# Altium schematic sheet aaa_Empty_Schematic.SchDoc: Title
size A3; Date: not used; ApprovedBy: not used; CheckedBy: not used; Author: not used; CompanyName: not used; DrawnBy: Drawn by; Engineer: not used; Organization: SMS-Lab; Address1: not used; Address2: not used; Address3: not used; Address4: not used; DocumentNumber: SMS-yyyy.m; Revision: 0; Time: not used; ModifiedDate: not used; ImagePath: not used
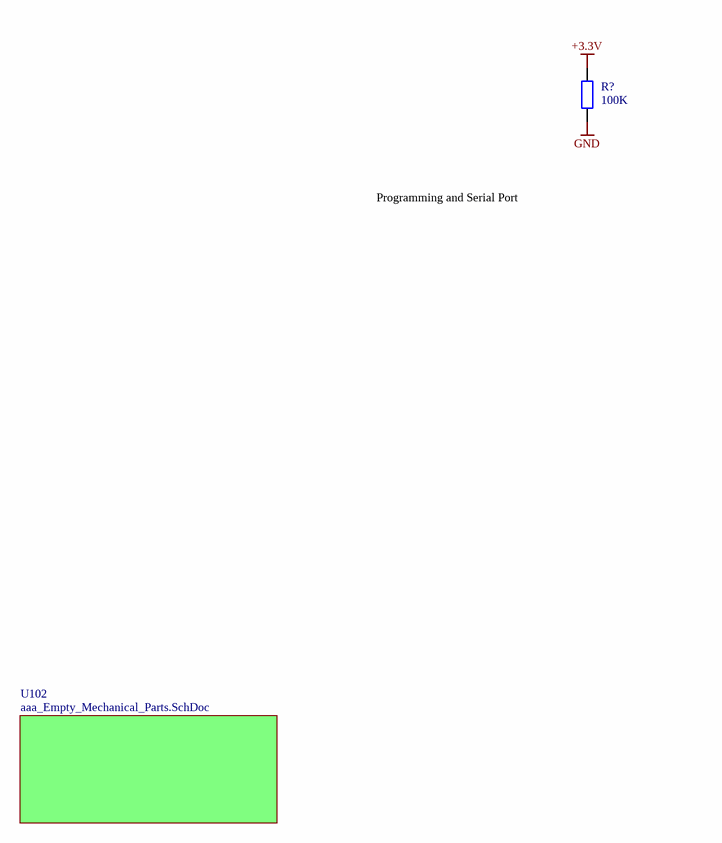
[diagram p0: aaa_Empty_Schematic.SchDoc]

## Parts
R?  100K  [SMD_0603]

## Sub-sheets
U102 = aaa_Empty_Mechanical_Parts.SchDoc: no entries

## Nets
+3.3V: R?.1
GND: R?.2

## Notes on the sheet
- Programming and Serial Port
- 1
- 2
- 3
- 4
- 5
- 6
- 7
- 8
- A
- B
- C
- D
- Zeichnungs Titel:
- Datum:
- Zeichnungsnummer:
- Rev:
- Format:
- A3
- Ersteller:
- Institut:
- Seite
- Projekt:
- von
- File:

## Library data of the parts
R? = RES_0603: 0603 SMD RESISTOR, 0.1 W; Latest Revision Made By: Jonas Giné; Latest Revision Note: New Parameters Added; Latest Revision Date: 25.11.13; ComponentLink1Description: Show Datasheet on SMS Drive; ComponentLink1URL: P:\Electronic Workshop\Datasheets (Refered in Libraries - Don't Change!)\; Value: 100K; Assembly Technology: SMD